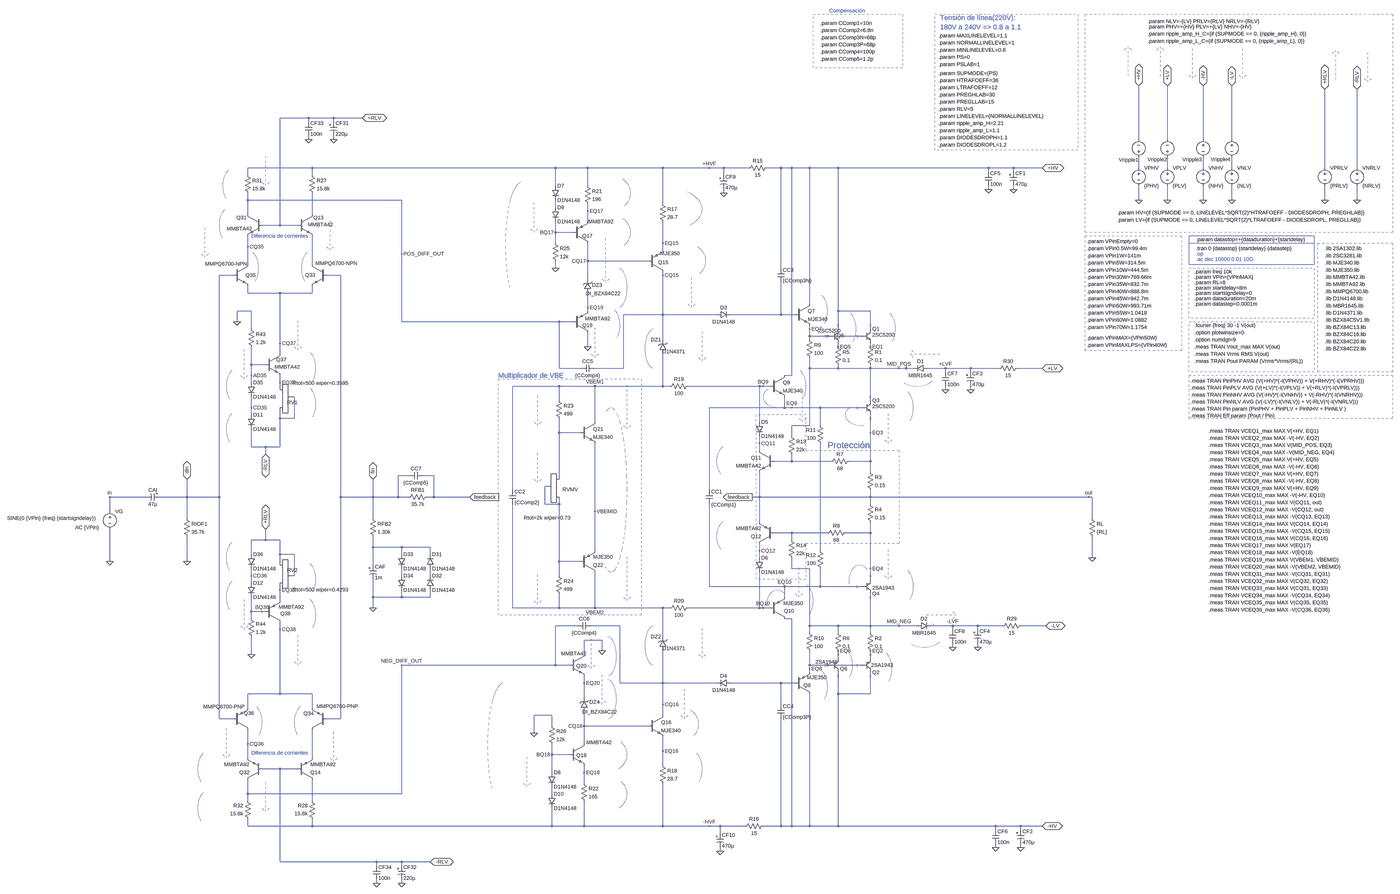
[diagram p0: schematic amplifier_V2.0_test.asc, whole sheet]
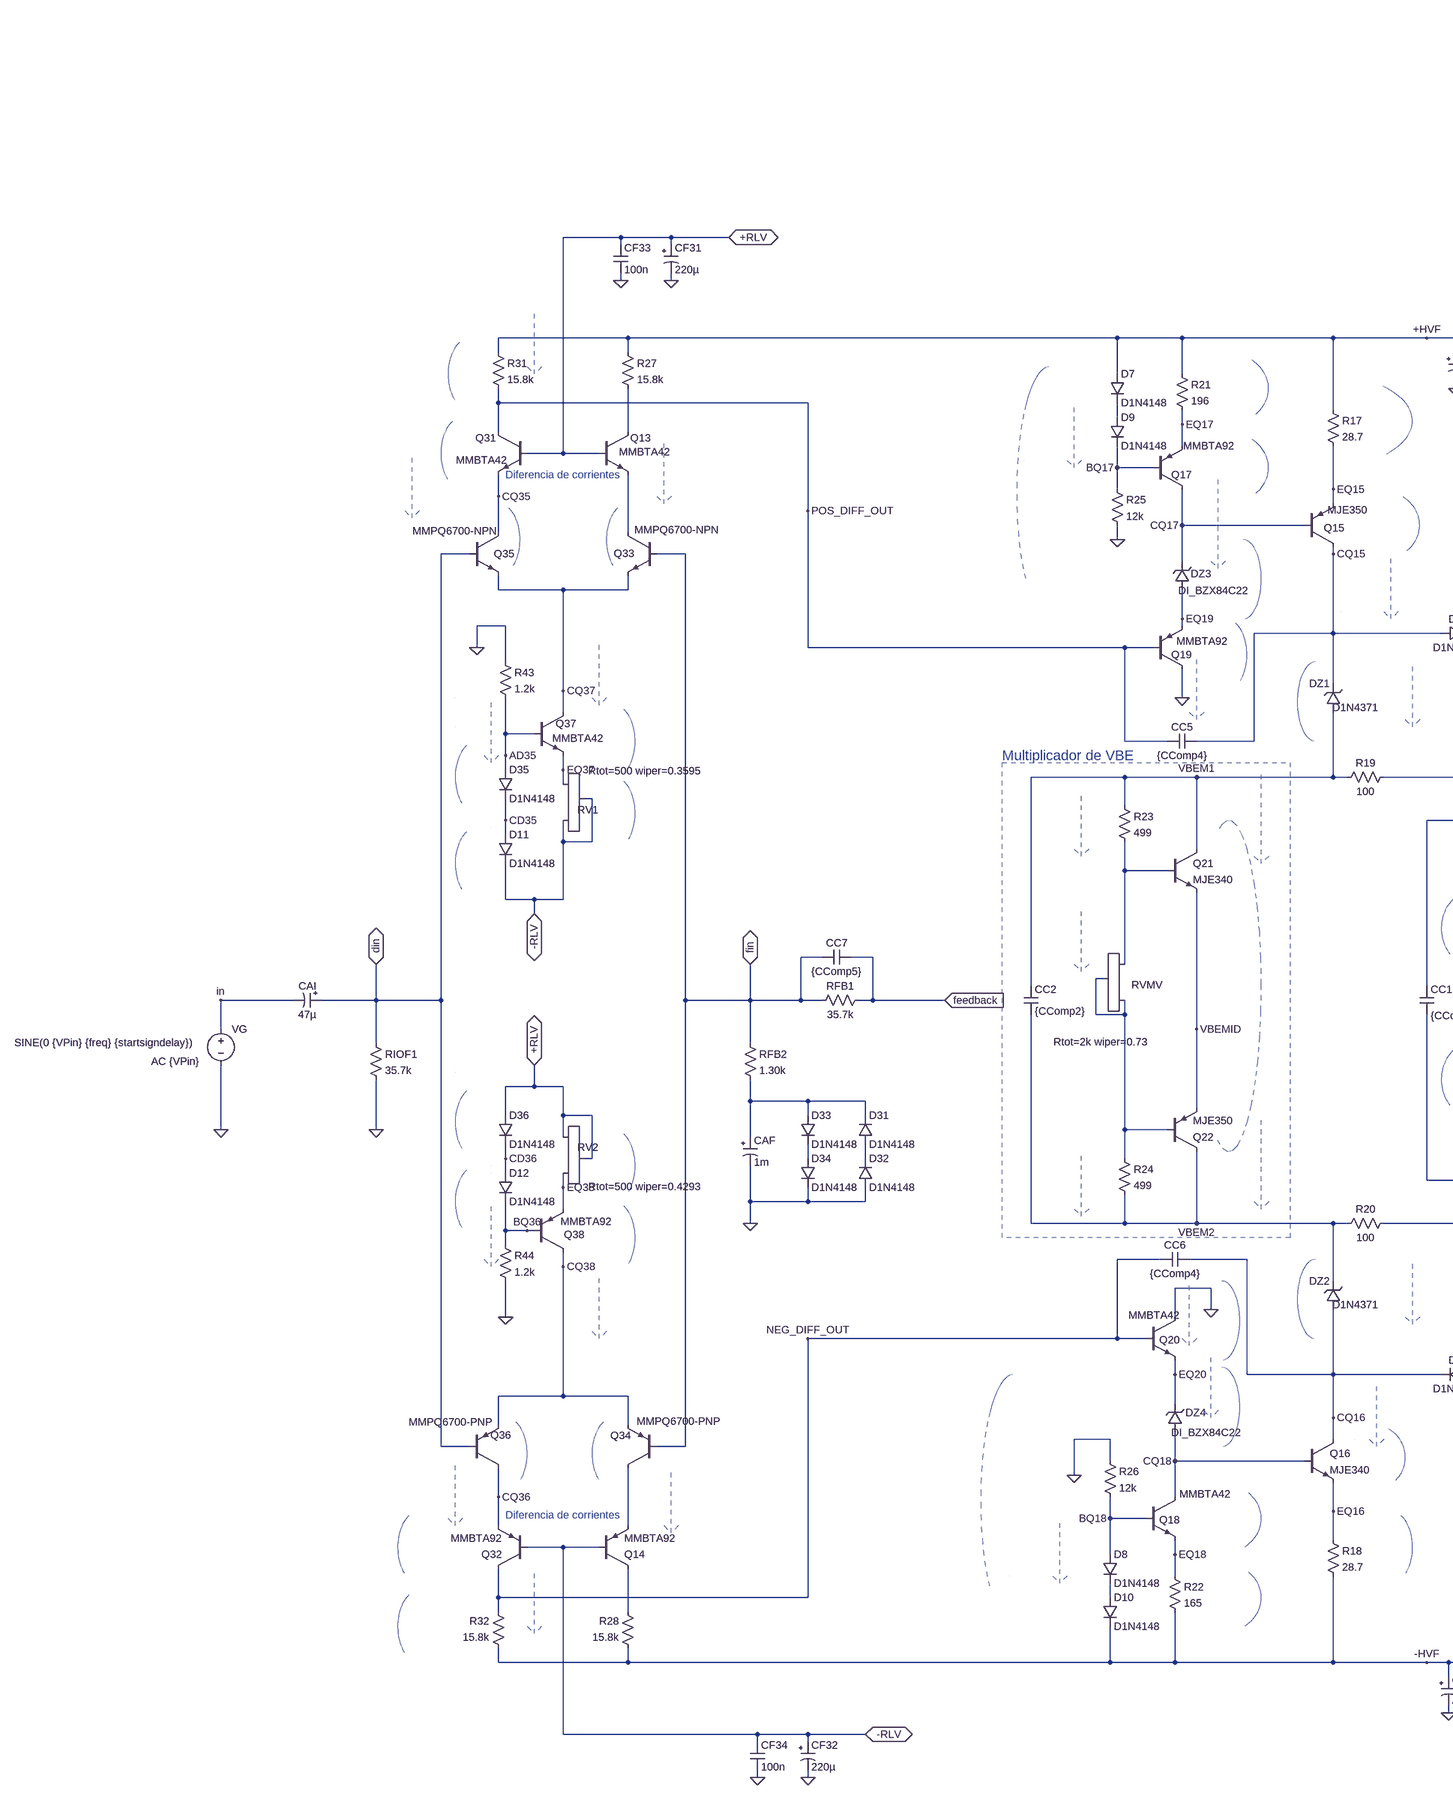
[diagram p1: schematic amplifier_V2.0_test.asc, part, row 1 of 1, column 1 of 2]
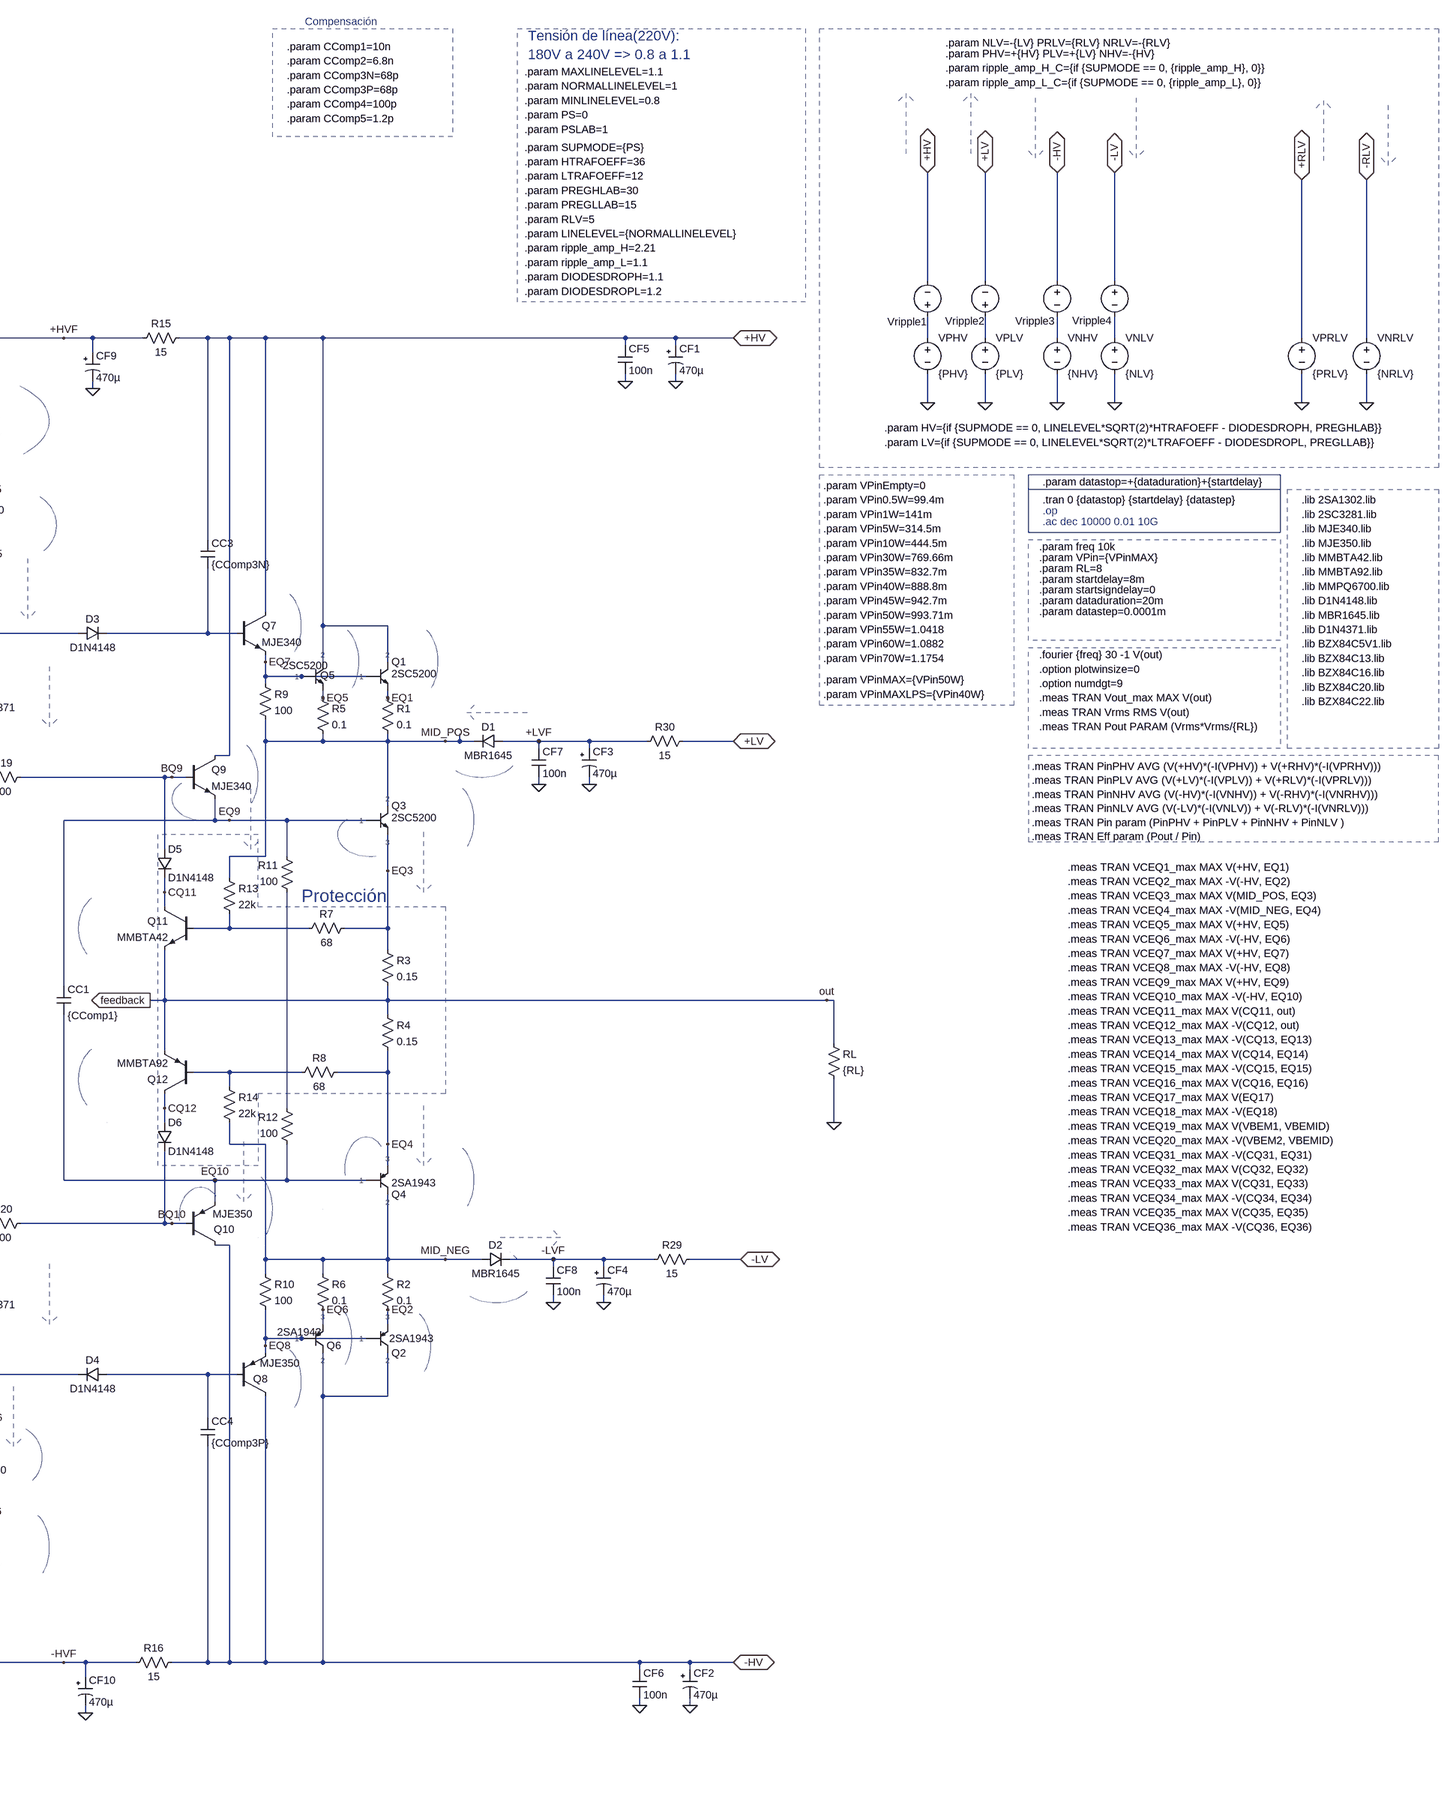
[diagram p2: schematic amplifier_V2.0_test.asc, part, row 1 of 1, column 2 of 2]
* amplifier_V2.0_test.asc
Q7 +HV N008 EQ7 0 MJE340
R9 EQ7 MID_POS 100
D3 CQ15 N008 D1N4148
Q9 +HV BQ9 EQ9 0 MJE340
R3 EQ3 feedback 0.15
R11 N014 EQ9 100
R4 feedback EQ4 0.15
Q10 -HV BQ10 EQ10 0 MJE350
Q8 -HV N017 EQ8 0 MJE350
D4 N017 CQ16 D1N4148
D2 MID_NEG -LVF MBR1645
R12 EQ10 N014 100
R2 MID_NEG EQ2 0.1
R6 MID_NEG EQ6 0.1
R5 EQ5 MID_POS 0.1
R1 EQ1 MID_POS 0.1
D1 +LVF MID_POS MBR1645
Q22 VBEM2 N011 VBEMID 0 MJE350
Q21 VBEM1 N009 VBEMID 0 MJE340
R23 VBEM1 N009 499
R24 N011 VBEM2 499
R19 BQ9 VBEM1 100
R20 BQ10 VBEM2 100
Q15 CQ15 CQ17 EQ15 0 MJE350
Q16 CQ16 CQ18 EQ16 0 MJE340
Q20 0 NEG_DIFF_OUT EQ20 0 MMBTA42
RFB2 fin N013 1.30k
RFB1 feedback fin 35.7k
RIOF1 din 0 35.7k
Q19 0 POS_DIFF_OUT EQ19 0 MMBTA92
Q35 CQ35 din CQ37 0 MMPQ6700-NPN
Q33 N007 fin CQ37 0 MMPQ6700-NPN
Q36 CQ36 din CQ38 0 MMPQ6700-PNP
Q34 N018 fin CQ38 0 MMPQ6700-PNP
CC5 CQ15 POS_DIFF_OUT {CComp4}
CC6 CQ16 NEG_DIFF_OUT {CComp4}
R17 +HVF EQ15 28.7
R18 EQ16 -HVF 28.7
XQ5 +HV EQ7 EQ5 2SC5200  ; pins 2 1 3
XQ1 +HV EQ7 EQ1 2SC5200  ; pins 2 1 3
XQ3 MID_POS EQ9 EQ3 2SC5200  ; pins 2 1 3
XQ4 MID_NEG EQ10 EQ4 2SA1943  ; pins 2 1 3
XQ6 -HV EQ8 EQ6 2SA1943  ; pins 2 1 3
XQ2 -HV EQ8 EQ2 2SA1943  ; pins 2 1 3
R43 0 AD35 1.2k
Q37 CQ37 AD35 EQ37 0 MMBTA42
Q38 CQ38 BQ36 EQ38 0 MMBTA92
R44 BQ36 0 1.2k
RL feedback 0 {RL}
CC4 N017 -HV {CComp3P}
CC3 +HV N008 {CComp3N}
VG in 0 SINE(0 {VPin} {freq} {startsigndelay}) AC {VPin}
CF5 +HV 0 100n
CC7 feedback fin {CComp5}
XRVMV N011 N009 N011 Rtot=2k wiper=0.73
D36 +RLV CD36 D1N4148
D35 AD35 CD35 D1N4148
Q12 CQ12 N012 feedback 0 MMBTA92
Q11 CQ11 N010 feedback 0 MMBTA42
D5 BQ9 CQ11 D1N4148
R7 EQ3 N010 68
R8 EQ4 N012 68
D6 CQ12 BQ10 D1N4148
R13 MID_POS N010 22k
R14 N012 MID_NEG 22k
CF1 +HV 0 470µ
CF7 +LVF 0 100n
CF3 +LVF 0 470µ
CF8 -LVF 0 100n
CF4 -LVF 0 470µ
CF6 -HV 0 100n
CF2 -HV 0 470µ
CF33 +RLV 0 100n
CF31 +RLV 0 220µ
CF34 -RLV 0 100n
CF32 -RLV 0 220µ
CAF N013 0 1m
D33 N013 N015 D1N4148
D34 N015 0 D1N4148
D32 0 N016 D1N4148
D31 N016 N013 D1N4148
CAI din in 47µ
R10 MID_NEG EQ8 100
CC2 VBEM1 VBEM2 {CComp2}
VPHV N001 0 {PHV}
VPLV N002 0 {PLV}
VNHV N003 0 {NHV}
VNLV N004 0 {NLV}
VPRLV +RLV 0 {PRLV}
VNRLV -RLV 0 {NRLV}
DZ1 VBEM1 CQ15 D1N4371
DZ2 CQ16 VBEM2 D1N4371
CC1 EQ9 EQ10 {CComp1}
Q31 POS_DIFF_OUT +RLV CQ35 0 MMBTA42
R31 +HVF POS_DIFF_OUT 15.8k
Q32 NEG_DIFF_OUT -RLV CQ36 0 MMBTA92
R32 -HVF NEG_DIFF_OUT 15.8k
XDZ3 EQ19 CQ17 DI_BZX84C22  ; pins + -
XDZ4 CQ18 EQ20 DI_BZX84C22  ; pins + -
Q17 CQ17 BQ17 EQ17 0 MMBTA92
D7 +HVF N005 D1N4148
D9 N005 BQ17 D1N4148
R25 BQ17 0 12k
R21 +HVF EQ17 196
Q18 CQ18 BQ18 EQ18 0 MMBTA42
D8 BQ18 N019 D1N4148
D10 N019 -HVF D1N4148
R26 0 BQ18 12k
R22 EQ18 -HVF 165
R15 +HV +HVF 15
CF9 +HVF 0 470µ
R16 -HV -HVF 15
CF10 -HVF 0 470µ
Vripple4 -LV N004 PULSE({ripple_amp_L_C} 0 0 1m 9m 0 10m)
Vripple3 -HV N003 PULSE({ripple_amp_H_C} 0 0 1m 9m 0 10m)
Vripple1 N001 +HV PULSE({ripple_amp_H_C} 0 0 1m 9m 0 10m)
Vripple2 N002 +LV PULSE({ripple_amp_L_C} 0 0 1m 9m 0 10m)
D11 CD35 -RLV D1N4148
D12 CD36 BQ36 D1N4148
XRV1 -RLV EQ37 -RLV Rtot=500 wiper=0.3595 Rtap=0 tap=0.5
XRV2 +RLV EQ38 +RLV Rtot=500 wiper=0.4293 Rtap=0 tap=0.5
Q13 N006 +RLV N007 0 MMBTA42
R27 +HVF N006 15.8k
Q14 N020 -RLV N018 0 MMBTA92
R28 -HVF N020 15.8k
R29 -LV -LVF 15
R30 +LV +LVF 15
.model D D
.lib standard.dio
.model NPN NPN
.model PNP PNP
.lib standard.bjt
* Multiplicador de VBE
* Protección
* Diferencia de corrientes
* Diferencia de corrientes
.meas TRAN VCEQ1_max MAX V(+HV, EQ1)
.meas TRAN VCEQ2_max MAX -V(-HV, EQ2)
.meas TRAN VCEQ5_max MAX V(+HV, EQ5)
.meas TRAN VCEQ6_max MAX -V(-HV, EQ6)
.meas TRAN VCEQ3_max MAX V(MID_POS, EQ3)
.meas TRAN VCEQ4_max MAX -V(MID_NEG, EQ4)
.meas TRAN VCEQ7_max MAX V(+HV, EQ7)
.meas TRAN VCEQ8_max MAX -V(-HV, EQ8)
.meas TRAN VCEQ9_max MAX V(+HV, EQ9)
.meas TRAN VCEQ10_max MAX -V(-HV, EQ10)
.meas TRAN VCEQ11_max MAX V(CQ11, out)
.meas TRAN VCEQ12_max MAX -V(CQ12, out)
.meas TRAN VCEQ13_max MAX -V(CQ13, EQ13)
.meas TRAN VCEQ14_max MAX V(CQ14, EQ14)
.meas TRAN VCEQ15_max MAX -V(CQ15, EQ15)
.meas TRAN VCEQ16_max MAX V(CQ16, EQ16)
.meas TRAN VCEQ17_max MAX V(EQ17)
.meas TRAN VCEQ18_max MAX -V(EQ18)
.meas TRAN VCEQ19_max MAX V(VBEM1, VBEMID)
.meas TRAN VCEQ20_max MAX -V(VBEM2, VBEMID)
.meas TRAN VCEQ31_max MAX -V(CQ31, EQ31)
.meas TRAN VCEQ32_max MAX V(CQ32, EQ32)
.meas TRAN VCEQ33_max MAX V(CQ31, EQ33)
.meas TRAN VCEQ34_max MAX -V(CQ34, EQ34)
.meas TRAN VCEQ35_max MAX V(CQ35, EQ35)
.meas TRAN VCEQ36_max MAX -V(CQ36, EQ36)
.tran 0 {datastop} {startdelay} {datastep}
.param freq 10k
* .op
.fourier {freq} 30 -1 V(out)
.lib 2SA1302.lib
.lib 2SC3281.lib
.lib MBR1645.lib
.lib MJE340.lib
.lib MJE350.lib
.lib D1N4148.lib
* .ac dec 10000 0.01 10G
.param VPin={VPinMAX}
.lib BZX84C5V1.lib
.lib MMBTA42.lib
.lib MMBTA92.lib
.lib MMPQ6700.lib
.option plotwinsize=0
.meas TRAN Vrms RMS V(out)
.meas TRAN Pout PARAM (Vrms*Vrms/{RL})
.option numdgt=9
.meas TRAN Vout_max MAX V(out)
.param RL=8
.meas TRAN PinPHV AVG (V(+HV)*(-I(VPHV)) + V(+RHV)*(-I(VPRHV)))
.meas TRAN PinPLV AVG (V(+LV)*(-I(VPLV)) + V(+RLV)*(-I(VPRLV)))
.meas TRAN PinNHV AVG (V(-HV)*(-I(VNHV)) + V(-RHV)*(-I(VNRHV)))
.meas TRAN PinNLV AVG (V(-LV)*(-I(VNLV)) + V(-RLV)*(-I(VNRLV)))
.meas TRAN Pin param (PinPHV + PinPLV + PinNHV + PinNLV )
.meas TRAN Eff param (Pout / Pin)
.param PHV=+{HV} PLV=+{LV} NHV=-{HV}
.param HV={if {SUPMODE == 0, LINELEVEL*SQRT(2)*HTRAFOEFF - DIODESDROPH, PREGHLAB}}
.param LV={if {SUPMODE == 0, LINELEVEL*SQRT(2)*LTRAFOEFF - DIODESDROPL, PREGLLAB}}
.param RLV=5
.param NLV=-{LV} PRLV={RLV} NRLV=-{RLV}
.param HTRAFOEFF=36
.param LTRAFOEFF=12
.param LINELEVEL={NORMALLINELEVEL}
* Tensión de línea(220V):
* 180V a 240V => 0.8 a 1.1
.param MAXLINELEVEL=1.1
.param MINLINELEVEL=0.8
.lib D1N4371.lib
.param VPin1W=141m
.param VPin5W=314.5m
.param VPin10W=444.5m
.param VPin45W=942.7m
.param VPin50W=993.71m
.param VPin30W=769.66m
.param VPin0.5W=99.4m
.param VPinMAX={VPin50W}
.param NORMALLINELEVEL=1
.param VPinEmpty=0
.lib BZX84C13.lib
.param VPinMAXLPS={VPin40W}
.lib BZX84C16.lib
.param VPin40W=888.8m
.param startdelay=8m
.param SUPMODE={PS}
.param PREGHLAB=30
.param PREGLLAB=15
.param VPin35W=832.7m
.lib BZX84C20.lib
.param CComp1=10n
.param CComp3N=68p
.param CComp4=100p
* Compensación
.param CComp3P=68p
.param CComp5=1.2p
.param CComp2=6.8n
.lib BZX84C22.lib
.param DIODESDROPH=1.1
.param DIODESDROPL=1.2
.param ripple_amp_H_C={if {SUPMODE == 0, {ripple_amp_H}, 0}}
.param ripple_amp_L_C={if {SUPMODE == 0, {ripple_amp_L}, 0}}
.param ripple_amp_H=2.21
.param ripple_amp_L=1.1
.param startsigndelay=0
.param dataduration=20m
.param datastop=+{dataduration}+{startdelay}
.param PS=0
.param PSLAB=1
.param VPin55W=1.0418
.param VPin60W=1.0882
.param VPin70W=1.1754
.param datastep=0.0001m
.lib 2SC5200.mod
.lib 2SA1943.mod
.backanno
.end